# Altium schematic sheet GBA_DMG.schdoc
size 260 x 181 mm
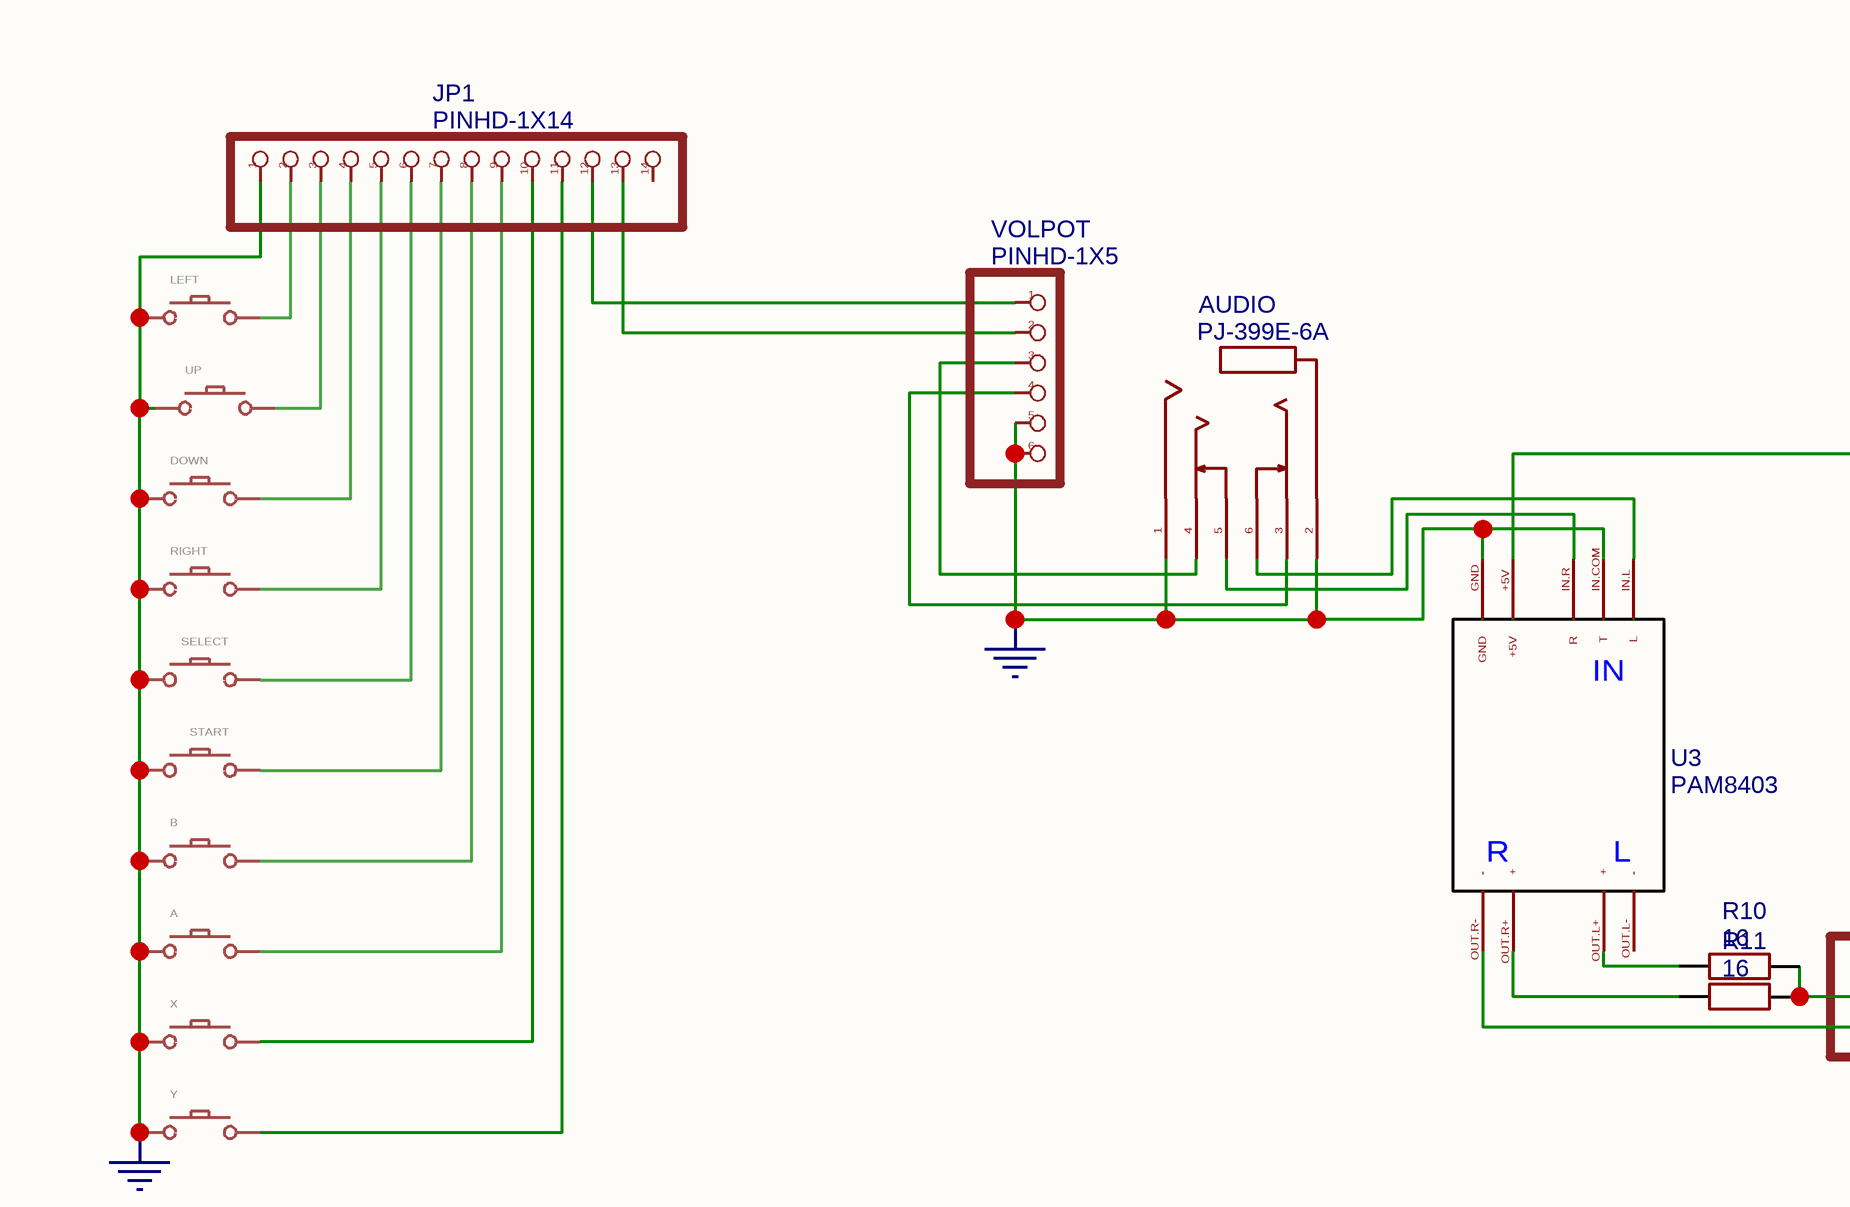
[diagram p0: GBA_DMG.schdoc, top left]
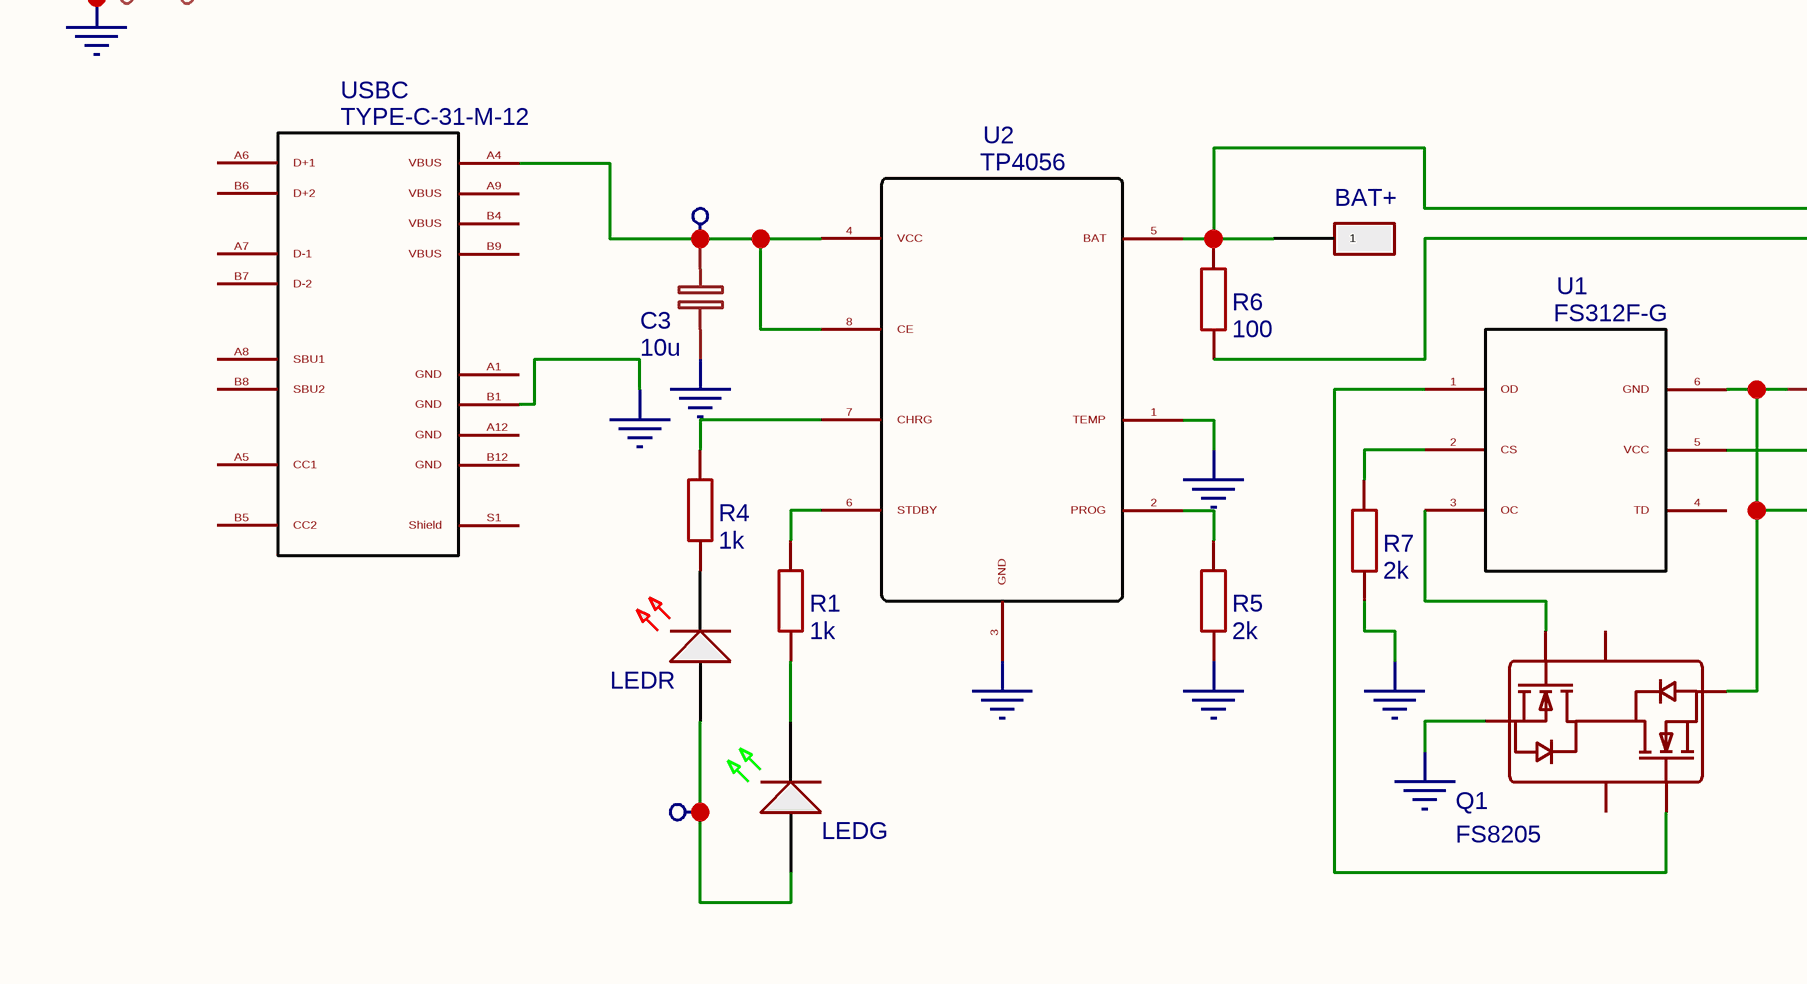
[diagram p1: GBA_DMG.schdoc, bottom left]
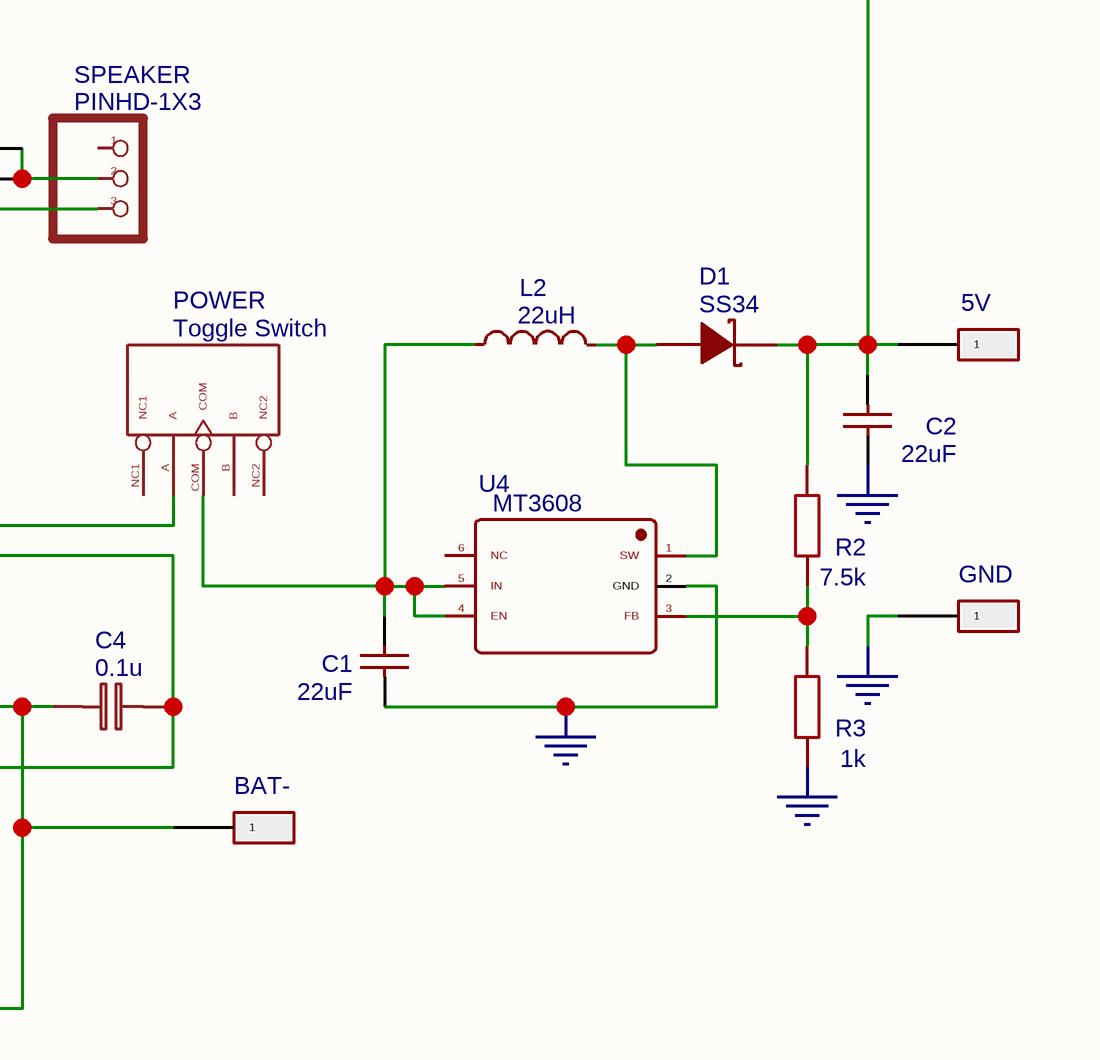
[diagram p2: GBA_DMG.schdoc, bottom right]

## Parts
5V  5V  [HDR-1X1/2.54]  (value not drawn)
A  DMG-BTN  [DMG-BTN]  (value not drawn)
AUDIO  PJ-399E-6A  [PJ-399E-6A]
B  DMG-BTN  [DMG-BTN]  (value not drawn)
BAT+  BAT+  [HDR-1X1/2.54]  (value not drawn)
BAT-  BAT-  [HDR-1X1/2.54]  (value not drawn)
C1  22uF  [1812]
C2  22uF  [1812]
C3  10u  [0603]
C4  0.1u  [0603]
D1  SS34  [SMA(DO-214AC)]
DOWN  DMG-BTN  [DMG-BTN]  (value not drawn)
GND  GND  [HDR-1X1/2.54]  (value not drawn)
JP1  PINHD-1X14  [1X14]
L2  22uH  [7*7*4]
LEDG  19-217/GHC-YR1S2/3T  [LED-0603]  (value not drawn)
LEDR  Red(0603)  [LED-0603]  (value not drawn)
LEFT  DMG-BTN  [DMG-BTN]  (value not drawn)
POWER  Toggle Switch  [SW5-2.0-8.8X4.4X4.7MM-90D]
Q1  FS8205  [SOT-23-6]
R1  1k  [0603]
R2  7.5k  [0603]
R3  1k  [0603]
R4  1k  [0603]
R5  2k  [0603]
R6  100  [0603]
R7  2k  [0603]
R10  16  [0805]
R11  16  [0805]
RIGHT  DMG-BTN  [DMG-BTN]  (value not drawn)
SELECT  DMG-BTN  [DMG-SEL]  (value not drawn)
SPEAKER  PINHD-1X3  [1X03-CLEANBIG]
START  DMG-BTN  [DMG-SEL]  (value not drawn)
U1  FS312F-G  [SOT-23-6]
U2  TP4056  [SOP-8_EP_150MIL]
U3  PAM8403  [AMPLIFIER-PAM8403]
U4  MT3608  [SOT-23-6]
UP  DMG-BTN  [DMG-BTN]  (value not drawn)
USBC  TYPE-C-31-M-12  [TYPE-C-31-M-12]
VOLPOT  PINHD-1X5  [1X06]
X  DMG-BTN  [DMG-BTN]  (value not drawn)
Y  DMG-BTN  [DMG-BTN]  (value not drawn)

## Nets
GND: A.P$1 AUDIO.1 AUDIO.2 B.P$1 C1.1 C2.2 C3.2 DOWN.P$1 GND.1 JP1.1 LEFT.P$1 Q1.1(S1) R3.1 R5.1 R7.1 RIGHT.P$1 SELECT.P$2 START.P$2 U2.1(TEMP) U2.3(GND) U3.GND U3.IN.COM(T) U4.2(GND) UP.P$1 USBC.B1(GND) VOLPOT.5 VOLPOT.6 X.P$1 Y.P$1
VBUS: C3.1 LEDG.1(A) LEDR.1(A) U2.4(VCC) U2.8(CE) USBC.A4(VBUS)
Net5V_1: 5V.1 C2.1 D1.2(K) R2.2 U3.+5V
NetA_P$2: A.P$2 JP1.9
NetAUDIO_3: AUDIO.3 VOLPOT.4
NetAUDIO_4: AUDIO.4 VOLPOT.3
NetAUDIO_5: AUDIO.5 U3.IN.R(R)
NetAUDIO_6: AUDIO.6 U3.IN.L(L)
NetB_P$2: B.P$2 JP1.8
NetBAT+_1: BAT+.1 POWER.A R6.2 U2.5(BAT)
NetBAT-_1: BAT-.1 C4.1 Q1.3(S2) U1.6(GND)
NetC1_2: C1.2 L2.1 POWER.COM U4.4(EN) U4.5(IN)
NetC4_2: C4.2 R6.1 U1.5(VCC)
NetD1_1: D1.1(A) L2.2 U4.1(SW)
NetDOWN_P$2: DOWN.P$2 JP1.4
NetJP1_2: JP1.2 LEFT.P$2
NetJP1_3: JP1.3 UP.P$2
NetJP1_5: JP1.5 RIGHT.P$2
NetJP1_6: JP1.6 SELECT.P$1
NetJP1_7: JP1.7 START.P$1
NetJP1_10: JP1.10 X.P$2
NetJP1_11: JP1.11 Y.P$2
NetJP1_12: JP1.12 VOLPOT.1
NetJP1_13: JP1.13 VOLPOT.2
NetLEDG_2: LEDG.2(C) R1.1
NetLEDR_2: LEDR.2(C) R4.1
NetQ1_4: Q1.4(G2) U1.1(OD)
NetQ1_6: Q1.6(G1) U1.3(OC)
NetR1_2: R1.2 U2.6(STDBY)
NetR2_1: R2.1 R3.2 U4.3(FB)
NetR4_2: R4.2 U2.7(CHRG)
NetR5_2: R5.2 U2.2(PROG)
NetR7_2: R7.2 U1.2(CS)
NetR10_1: R10.1 U3.OUT.L+(+)
NetR10_2: R10.2 R11.2 SPEAKER.2
NetR11_1: R11.1 U3.OUT.R+(+)
NetSPEAKER_3: SPEAKER.3 U3.OUT.R-(-)

Not connected (* = marked no-connect by the designer): JP1 14; POWER B NC1 NC2; Q1 2(D12) 5(D12); SPEAKER 1; U1 4(TD); U3 OUT.L-(-); U4 6(NC); USBC A1(GND) A5(CC1) A6(D+1) A7(D-1) A8(SBU1) A9(VBUS) A12(GND) B4(VBUS) B5(CC2) B6(D+2) B7(D-2) B8(SBU2) B9(VBUS) B12(GND) S1(Shield)

## Notes on the sheet
- (in symbol U3) IN

## Library data of the parts
5V BAT+ BAT- GND = (no symbol name): BOM_Manufacturer: LCSC; BOM_Manufacturer Part: Header-Male-2.54_1x1; BOM_Supplier: LCSC; spicePre: P; BOM_Supplier Part: C81276
AUDIO = (no symbol name): BOM_Manufacturer: HRO; Contributor: LCSC; BOM_Supplier: LCSC; BOM_Manufacturer Part: PJ-399E-6A; spicePre: A; BOM_Supplier Part: C128993
C1 C2 = (no symbol name): BOM_Manufacturer: FH; BOM_Manufacturer Part: 1812X226K250NT; Voltage: 25V; Tolerance: ±10%; Value: 22uF; BOM_Supplier: LCSC; spicePre: C; BOM_Supplier Part: C28504
C3 C4 = (no symbol name): nameAlias: Value(F); BOM_Manufacturer Part: ?; spicePre: C; spiceSymbolName: Capacitor
JP1 SPEAKER VOLPOT = (no symbol name): Contributor: Adafruit; BOM_Manufacturer Part: ?; spicePre: J
L2 = (no symbol name): BOM_Manufacturer: LCSC; BOM_Manufacturer Part: SMRH74-220MT; Value: 22uH; BOM_Supplier: LCSC; spicePre: L; BOM_Supplier Part: C27442
LEDG = (no symbol name): BOM_Manufacturer: EVERLIGHT; BOM_Supplier: LCSC; BOM_Manufacturer Part: 19-217/GHC-YR1S2/3T; spicePre: L; BOM_Supplier Part: C72043
LEDR = (no symbol name): BOM_Manufacturer: LCSC; BOM_Manufacturer Part: KT-0603R; BOM_Supplier: LCSC; spicePre: L; BOM_Supplier Part: C2286
POWER = (no symbol name): BOM_Manufacturer Part: 3P-2.0-90D-REINFORCE;; catid: 20; description: DIP Toggle Switch ON-ON; 0.3A- AC 500V; spicePre: S
Q1 = (no symbol name): BOM_Manufacturer: FORTUNE; BOM_Supplier: LCSC; BOM_Manufacturer Part: FS8205; spicePre: Q; BOM_Supplier Part: C32254
R1-R7 = (no symbol name): nameAlias: Value(Ω); BOM_Manufacturer Part: ?; spicePre: R; spiceSymbolName: Resistor
R10 R11 = (no symbol name): BOM_Manufacturer: UniOhm; BOM_Manufacturer Part: 0805W8J0202T5E; nameAlias: Value; Contributor: LCSC; BOM_Supplier: LCSC; spicePre: R; spiceSymbolName: 0805W8J0202T5E; BOM_Supplier Part: C1359
U1 = (no symbol name): BOM_Manufacturer: FORTUNE; BOM_Manufacturer Part: DW01+G; BOM_Supplier: LCSC; spicePre: U; BOM_Supplier Part: C14213
U2 = (no symbol name): BOM_Manufacturer: TOPPOWER; Contributor: Guest; BOM_Supplier: LCSC; BOM_Manufacturer Part: TP4056; spicePre: U; BOM_Supplier Part: C16581
U3 = (no symbol name): Contributor: kiranmalshikhare55; BOM_Manufacturer Part: PAM8403; spicePre: U
U4 = (no symbol name): BOM_Manufacturer: LCSC; BOM_Supplier: LCSC; BOM_Manufacturer Part: MT3608; spicePre: U; BOM_Supplier Part: C84817
USBC = (no symbol name): Contributor: marcelroder3; BOM_Manufacturer Part: ?; spicePre: C
A B D1 DOWN LEFT RIGHT SELECT START UP X Y = (no symbol name)
  D1: BOM_Supplier: LCSC; BOM_Manufacturer Part: SS34; spicePre: D; BOM_Supplier Part: C8678